# Altium schematic sheet kill_switch.SchDoc
size A
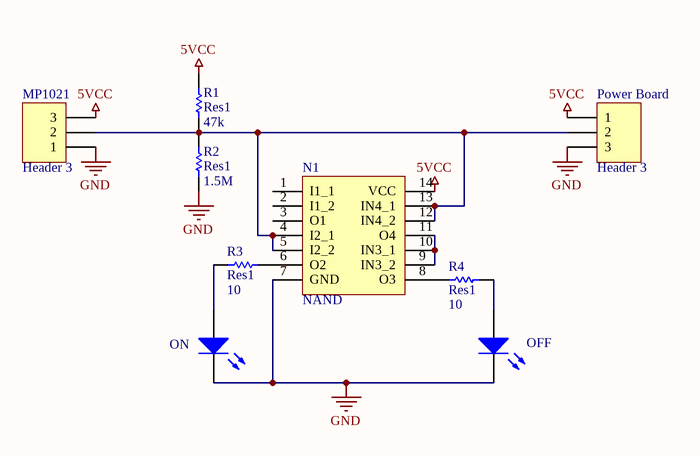
[diagram p0: kill_switch.SchDoc]

## Parts
MP1021  Header 3  [HDR1X3]
N1  NAND
OFF  LED2  [3.2X1.6X1.1]  (value not drawn)
ON  (no value)  [3.2X1.6X1.1]
Power_Board  Header 3  [HDR1X3]
R1  Res1  value 47k  [AXIAL-0.3]
R2  Res1  value 1.5M  [AXIAL-0.3]
R3  Res1  value 10  [AXIAL-0.3]
R4  Res1  value 10  [AXIAL-0.3]

## Nets
5VCC: MP1021.3 N1.14(VCC) Power_Board.1 R1.2
GND: MP1021.1 N1.7(GND) OFF.2(K) ON.2(K) Power_Board.3 R2.1
NetMP1021_2: MP1021.2 N1.4(I2_1) N1.5(I2_2) N1.12(IN4_2) N1.13(IN4_1) Power_Board.2 R1.1 R2.2
NetN1_6: N1.6(O2) R3.1
NetN1_8: N1.8(O3) R4.2
NetN1_9: N1.9(IN3_2) N1.10(IN3_1) N1.11(O4)
NetOFF_1: OFF.1(A) R4.1
NetON_1: ON.1(A) R3.2

Not connected (* = marked no-connect by the designer): N1 1(I1_1) 2(I1_2) 3(O1)

## Library data of the parts
MP1021 Power_Board = Header 3: Header, 3-Pin; LatestRevisionDate: 17-Jul-2002; LatestRevisionNote: Re-released for DXP Platform.; Publisher: Altium Limited
N1 = NAND: MM74HC00M
OFF = LED2: White CRE LED, max current 1A; Published: 8-Jun-2000; LatestRevisionDate: 17-Jul-2002; LatestRevisionNote: Re-released for DXP Platform.; PackageDocument: Feb-2002; PackageReference: 3.2X1.6X1.1; Publisher: Altium Limited
ON = LED2: Green CRE LED, max current .7A; Published: 8-Jun-2000; LatestRevisionDate: 17-Jul-2002; LatestRevisionNote: Re-released for DXP Platform.; PackageDocument: Feb-2002; PackageReference: 3.2X1.6X1.1; Publisher: Altium Limited
R1-R4 = Res1: Resistor; Published: 8-Jun-2000; LatestRevisionDate: 17-Jul-2002; LatestRevisionNote: Re-released for DXP Platform.; PackageReference: AXIAL-0.3; Publisher: Altium Limited